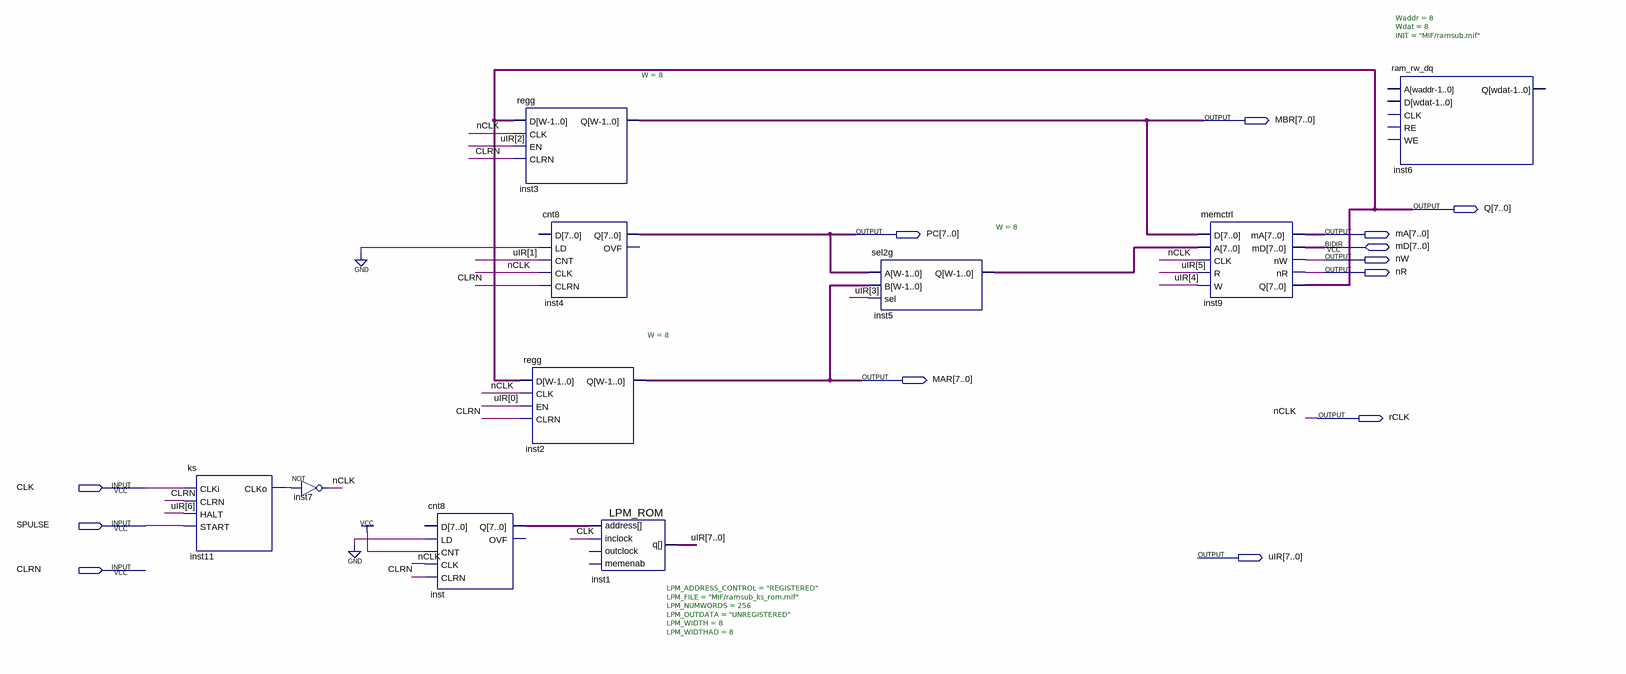
[diagram p0: schematic sheet]
// Quartus schematic mempin.bdf as structural Verilog: 10 symbols, 13 pins
module mempin (
  input  CLK,
  input  SPULSE,
  input  CLRN,
  inout  [7:0] mD,
  output [7:0] MBR,
  output [7:0] Q,
  output [7:0] PC,
  output [7:0] mA,
  output nW,
  output nR,
  output [7:0] MAR,
  output rCLK,
  output [7:0] uIR
);

  wire inst11_clko;
  wire [7:0] inst5_q, inst_q;

  ks inst11 (.CLKi(CLK), .CLRN(CLRN), .HALT(uIR[6]), .START(SPULSE), .CLKo(inst11_clko));
  not inst7 (rCLK, inst11_clko);
  cnt8 inst (.LD(1'b0), .CNT(1'b1), .CLK(rCLK), .CLRN(CLRN), .Q(inst_q));  // open: D, OVF
  regg #(.W(8)) inst3 (.D(Q), .CLK(rCLK), .EN(uIR[2]), .CLRN(CLRN), .Q(MBR));
  regg #(.W(8)) inst2 (.D(Q), .CLK(rCLK), .EN(uIR[0]), .CLRN(CLRN), .Q(MAR));
  cnt8 inst4 (.LD(1'b0), .CNT(uIR[1]), .CLK(rCLK), .CLRN(CLRN), .Q(PC));  // open: D, OVF
  LPM_ROM #(.LPM_ADDRESS_CONTROL("REGISTERED"), .LPM_FILE("MIF/ramsub_ks_rom.mif"), .LPM_NUMWORDS(256), .LPM_OUTDATA("UNREGISTERED"), .LPM_WIDTH(8), .LPM_WIDTHAD(8)) inst1 (
    .address(inst_q), .inclock(CLK), .q(uIR));  // open: outclock, memenab
  sel2g #(.W(8)) inst5 (.A(PC), .B(MAR), .sel(uIR[3]), .Q(inst5_q));
  memctrl inst9 (.D(MBR), .A(inst5_q), .CLK(rCLK), .R(uIR[5]), .W(uIR[4]), .mA(mA), .nW(nW), .nR(nR), .Q(Q), .mD(mD));
  ram_rw_dq #(.Waddr(8), .Wdat(8), .INIT("MIF/ramsub.mif")) inst6 ();  // open: A, D, CLK, RE, WE, Q

  // Other names for the same wires on the sheet: nCLK = rCLK
endmodule
